# EAGLE schematic GPS_radiologger_v10 (EAGLE 9.5.1)
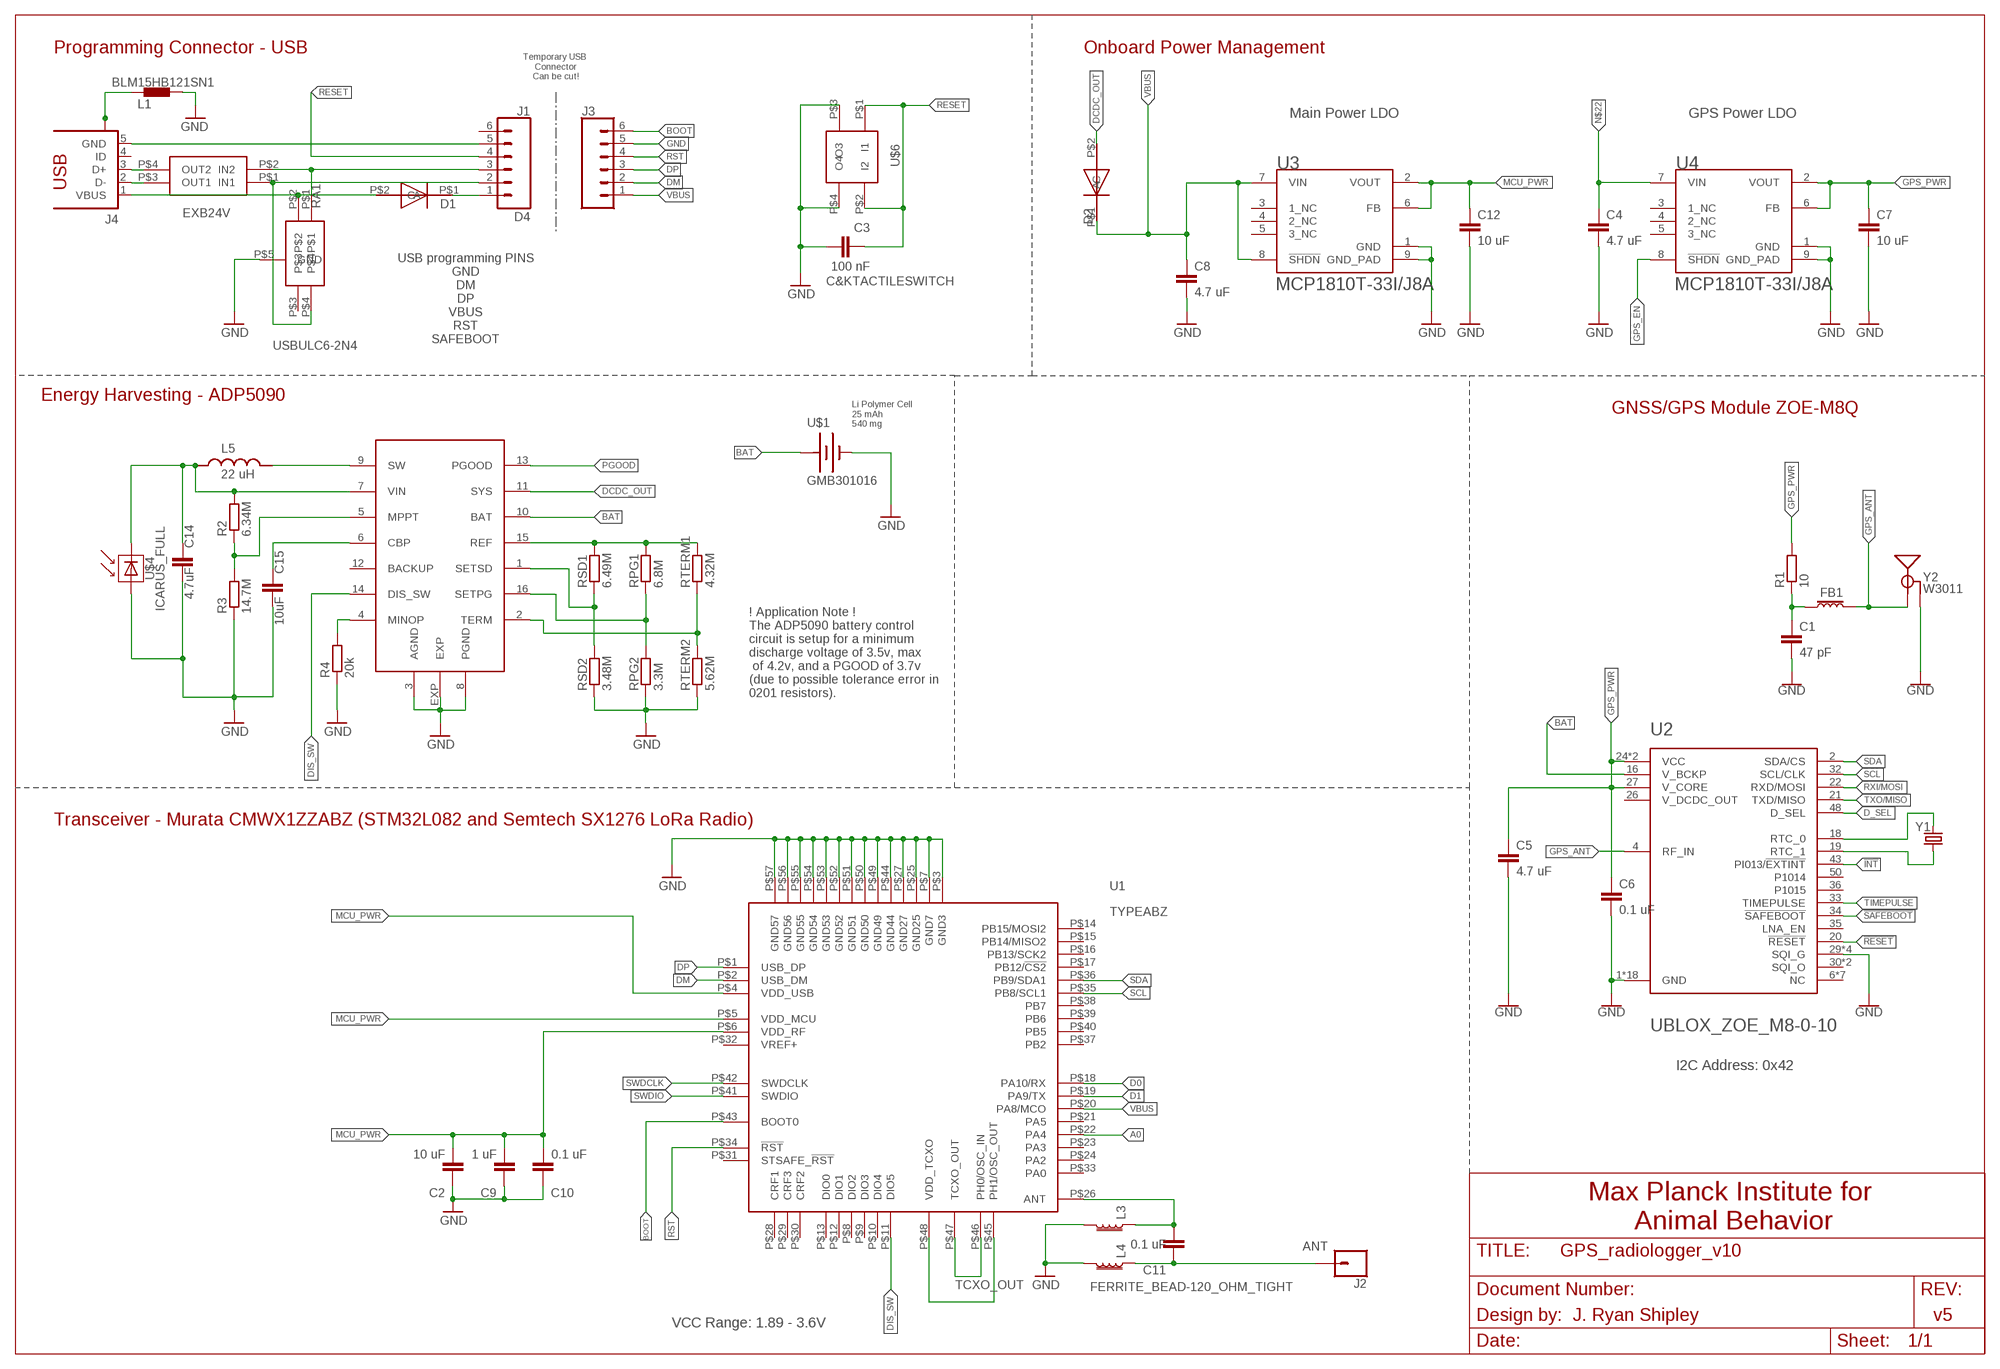
[diagram p0: schematic, sheet 1]

## Parts
C1  47 pF  C-EUC0201  [C0201]
C2  10 uF  C-EUC0201  [C0201]
C3  100 nF  0402CAP.KW  [0402-CAP]
C4  4.7 uF  C-EUC0201  [C0201]
C5  4.7 uF  C-EUC0201  [C0201]
C6  0.1 uF  C-EUC0201  [C0201]
C7  10 uF  C-EUC0201  [C0201]
C8  4.7 uF  C-EUC0201  [C0201]
C9  1 uF  C-EUC0201  [C0201]
C10  0.1 uF  C-EUC0201  [C0201]
C11  0.1 uF  C-EUC0201  [C0201]
C12  10 uF  C-EUC0201  [C0201]
C14  4.7uF  C-EUC0201  [C0201]
C15  10uF  C-EUC0402  [C0402]
D1  CDSQR4148-HF  [CDSQR4148-HF]
D2  CDSQR4148-HF  [CDSQR4148-HF]
D4  USBULC6-2N4  [USBULC6-2N4]
FB1  FERRITE_BEAD-120_OHM_TIGHT  [0402-TIGHT]
J1  CONN_061.27MM  [1X06_1.27MM]
J2  CONN_01PTH_NO_SILK_SMALL  [1X01_SMALL]
J3  CONN_061.27MM  [1X06_1.27MM]
J4  1981584-1  [1981584-1]
L1  BLM15HB121SN1  [0402]
L3  FERRITE_BEAD-120_OHM_TIGHT  [0402-TIGHT]
L4  FERRITE_BEAD-120_OHM_TIGHT  [0402-TIGHT]
L5  22 uH  LPS4012-103MRB  [IND_LPS4012-103MRB]
R1  10  R-EU_R0201  [R0201]
R2  6.34M  R-EU_R0201  [R0201]
R3  14.7M  R-EU_R0201  [R0201]
R4  20k  R-EU_R0201  [R0201]
RA1  EXB24V  [EXB24V]
RPG1  6.8M  R-EU_R0201  [R0201]
RPG2  3.3M  R-EU_R0201  [R0201]
RSD1  6.49M  R-EU_R0201  [R0201]
RSD2  3.48M  R-EU_R0201  [R0201]
RTERM1  4.32M  R-EU_R0201  [R0201]
RTERM2  5.62M  R-EU_R0201  [R0201]
U1  TYPEABZ  [TYPEABZ]
U2  UBLOX_ZOE_M8-0-10  [UBLOX_ZOE_M8-0-10]
U3  MICROCHIP_MCP1810T-33I-J8AMICROCHIP_MCP1810T-33I-J8A_0_0  [MICROCHIP_MCP1810T-33I-J8A_0]
U4  MICROCHIP_MCP1810T-33I-J8AMICROCHIP_MCP1810T-33I-J8A_0_0  [MICROCHIP_MCP1810T-33I-J8A_0]
U$1  GMB301016  [GMB301016]
U$3  ADP5090  [LFCSP-16-3X3]
U$4  ICARUS_FULL  [ICARUS_FULL]
U$6  C&KTACTILESWITCH  [C&KTACTILESWITCH]
Y1  32.768kHz  CRYSTAL-32.768KHZ  [CRYSTAL-SMD-1.0X1.2MM]
Y2  W3011  GPS_CHIP_ANTENNAW3011  [W3011]

## Nets
!INT: U2.43(PI013/!EXTINT)
!RESET: U2.20(!RESET)
!SAFEBOOT: U2.34(!SAFEBOOT)
A0: U1.P$22(PA4)
ANT: C11.1 J2.P$1 L4.1
BAT: U2.16(V_BCKP) U$1.+ U$3.10(BAT)
BOOT: J3.6 U1.P$43(BOOT0)
D0: U1.P$18(PA10/RX)
D1: U1.P$19(PA9/TX)
D_SEL: U2.48(D_SEL)
DCDC_OUT: D2.P$2(A) U$3.11(SYS)
DIS_SW: U1.P$11(DIO5) U$3.14(DIS_SW)
DM: J3.2 U1.P$2(USB_DM)
DM1: D4.P$4 J1.2 RA1.P$1(IN1)
DP: J3.3 U1.P$1(USB_DP)
DP1: D4.P$1 J1.3 RA1.P$2(IN2)
GND: C1.2 C2.1 C3.1 C4.2 C5.2 C6.2 C7.2 C8.2 C9.1 C10.1 C12.2 C14.2 C15.2 D4.P$5(GND) J1.5 J3.5 J4.5(GND) L1.2 L3.2 L4.2 R3.1 R4.1 RPG2.1 RSD2.1 RTERM2.1 U1.P$3(GND3) U1.P$7(GND7) U1.P$25(GND25) U1.P$27(GND27) U1.P$44(GND44) U1.P$49(GND49) U1.P$50(GND50) U1.P$51(GND51) U1.P$52(GND52) U1.P$53(GND53) U1.P$54(GND54) U1.P$55(GND55) U1.P$56(GND56) U1.P$57(GND57) U2.1(GND) U2.3(GND) U2.5(GND) U2.7(GND) U2.8(GND) U2.9(GND) U2.10(GND) U2.11(GND) U2.12(GND) U2.17(GND) U2.23(GND) U2.29(SQI_G) U2.31(SQI_G) U2.37(GND) U2.38(GND) U2.39(GND) U2.40(GND) U2.41(GND) U2.44(GND) U2.46(SQI_G) U2.47(SQI_G) U2.49(GND) U3.1(GND) U3.9(GND_PAD) U4.1(GND) U4.9(GND_PAD) U$1.- U$4.P$2(MINUS) U$6.P$3(O3) U$6.P$4(O4) Y2.2(GND) Y2.3(GND)
GPS_ANT: FB1.1 U2.4(RF_IN) Y2.1(SIGNAL)
GPS_EN: U4.8(!SHDN!)
GPS_PWR: C5.1 C6.1 C7.1 R1.2 U2.24(VCC) U2.25(VCC) U2.27(V_CORE) U4.2(VOUT) U4.6(FB)
MCU_PWR: C2.2 C9.2 C10.2 C12.1 U1.P$4(VDD_USB) U1.P$5(VDD_MCU) U1.P$6(VDD_RF) U3.2(VOUT) U3.6(FB)
N$1: U1.P$45(PH1/OSC_OUT) U1.P$48(VDD_TCXO)
N$2: D1.P$1(C) J1.1
N$5: L5.2 U$3.9(SW)
N$6: U$3.3(AGND) U$3.8(PGND) U$3.EXP ; supply symbol labelled GND
N$7: R2.1 R3.2 U$3.5(MPPT)
N$8: C15.1 U$3.6(CBP)
N$9: C1.1 FB1.2 R1.1
N$10: R4.2 U$3.4(MINOP)
N$11: RTERM1.1 RTERM2.2 U$3.2(TERM)
N$12: RPG1.1 RPG2.2 U$3.16(SETPG)
N$14: U2.18(RTC_0) Y1.P$2
N$15: U2.19(RTC_1) Y1.P$1
N$16: RSD1.1 RSD2.2 U$3.1(SETSD)
N$17: RPG1.2 RSD1.2 RTERM1.2 U$3.15(REF)
N$22: C4.1 U4.7(VIN)
N$31: J4.3(D+) RA1.P$4(OUT2)
N$32: C11.2 L3.1 U1.P$26(ANT)
N$33: J4.2(D-) RA1.P$3(OUT1)
PGOOD: U$3.13(PGOOD)
RESET: C3.2 J1.4 U$6.P$1(I1) U$6.P$2(I2)
RST: J3.4 U1.P$34(!RST)
RXI/MOSI: U2.22(RXD/MOSI)
SCL: U1.P$35(PB8/SCL1) U2.32(SCL/CLK)
SDA: U1.P$36(PB9/SDA1) U2.2(SDA/CS)
SWDCLK: U1.P$42(SWDCLK)
SWDIO: U1.P$41(SWDIO)
TCXO_OUT: U1.P$46(PH0/OSC_IN) U1.P$47(TCXO_OUT)
TIMEPULSE: U2.33(TIMEPULSE)
TXO/MISO: U2.21(TXD/MISO)
USB_SHIELD: J4.S1 J4.S2 J4.S3 J4.S4 L1.1
VBUS: C8.1 D2.P$1(C) J3.1 U1.P$20(PA8/MCO) U3.7(VIN) U3.8(!SHDN!)
VBUS1: D1.P$2(A) D4.P$2 J4.1(VBUS)
VIN: C14.1 L5.1 R2.2 U$3.7(VIN) U$4.P$1(PLUS)
Unconnected: D4.P$3 J1.6 J4.4(ID) U1.P$8(DIO2) U1.P$9(DIO3) U1.P$10(DIO4) U1.P$12(DIO1) U1.P$13(DIO0) U1.P$14(PB15/MOSI2) U1.P$15(PB14/MISO2) U1.P$16(PB13/SCK2) U1.P$17(PB12/!CS2) U1.P$21(PA5) U1.P$23(PA3) U1.P$24(PA2) U1.P$28(CRF1) U1.P$29(CRF3) U1.P$30(CRF2) U1.P$31(STSAFE_!RST) U1.P$33(PA0) U1.P$37(PB2) U1.P$38(PB7) U1.P$39(PB6) U1.P$40(PB5) U2.6(NC) U2.13(NC) U2.14(NC) U2.15(NC) U2.28(NC) U2.30(SQI_O) U2.35(LNA_EN) U2.36(P1015) U2.42(NC) U2.45(SQI_O) U2.50(P1014) U2.51(NC) U3.3(1_NC) U3.4(2_NC) U3.5(3_NC) U4.3(1_NC) U4.4(2_NC) U4.5(3_NC) U$3.12(BACKUP)

## Notes on the sheet
- Programming Connector - USB | Onboard Power Management
- Temporary USB 
  Connector
  Can be cut!
- Main Power LDO | GPS Power LDO
- USB programming PINS
  GND
  DM
  DP
  VBUS
  RST
  SAFEBOOT
- Energy Harvesting - ADP5090
- GNSS/GPS Module ZOE-M8Q
- Li Polymer Cell
  25 mAh
  540 mg
- ! Application Note !
  The ADP5090 battery control
  circuit is setup for a minimum
  discharge voltage of 3.5v, max
   of 4.2v, and a PGOOD of 3.7v
  (due to possible tolerance error in 
  0201 resistors).
- Transceiver - Murata CMWX1ZZABZ (STM32L082 and Semtech SX1276 LoRa Radio)
- I2C Address: 0x42
- Max Planck Institute for 
  Animal Behavior
- Design by: | J. Ryan Shipley | v5
- VCC Range: 1.89 - 3.6V

## Power pins joined to a net without a drawn wire
V_DCDC_OUT: U2.26(V_DCDC_OUT)
VREF+: U1.P$32(VREF+)

## Library data of the parts
C1 C2 C4-C12 C14 = rcl:C-EU: CAPACITOR, European symbol; SPICEPREFIX: C
C3 = SparkFun-Capacitors:0402CAP.KW
C15 = resistor:C-EU: CAPACITOR, European symbol
D1 D2 = Kris:CDSQR4148-HF: ComChip's CDSQR4148-HF high speed 150 mA Io diode
D4 = Kris:USBULC6-2N4: ST TVS diode ESD Protection USBULC6-2N4
FB1 L3 L4 = SparkFun-Coils:FERRITE_BEAD-120_OHM_TIGHT
J1 J3 = SparkFun-Connectors:CONN_06: Multi connection point. Often used as Generic Header-pin footprint for 0.1 inch spaced/style header connections On any of the 0.1 inch spaced packages, you can populate with these: Break Away Headers - Straight <https://www.sparkfun.com/products/116> (PRT-00116) Break Away Male Headers - Right Angle <https://www.sparkfun.com/products/553> (PRT-00553) Female Headers <https://www.sparkfun.com/products/115> (PRT-00115) Break Away Headers - Machine Pin <https://www.sparkfun.com/products/117> (PRT-00117) Break Away Female Headers - Swiss Machine Pin <https://www.sparkfun.com/products/743> (PRT-00743) Arduino Stackable Header - 6 Pin <https://www.sparkfun.com/products/9280> (PRT-09280) For SCREWTERMINALS and SPRING TERMINALS visit here: Screw Terimnals on SparkFun.com <https://www.sparkfun.com/search/results?term=Screw+Terminals> (5mm/3.5mm/2.54mm spacing) This device is also useful as a general connection point to wire up your design to another part of your project. Our various solder wires solder well into these plated through hole pads. Hook-Up Wire - Assortment (Stranded, 22 AWG) <https://www.sparkfun.com/products/11375> (PRT-11375) Hook-Up Wire - Assortment (Solid Core, 22 AWG) <https://www.sparkfun.com/products/11367> (PRT-11367) View the entire wire category on our website here <https://www.sparkfun.com/categories/141>
J2 = SparkFun-Connectors:CONN_01: Single connection point. Often used as Generic Header-pin footprint for 0.1 inch spaced/style header connections On any of the 0.1 inch spaced packages, you can populate with these: Break Away Headers - Straight <https://www.sparkfun.com/products/116> (PRT-00116) Break Away Male Headers - Right Angle <https://www.sparkfun.com/products/553> (PRT-00553) Female Headers <https://www.sparkfun.com/products/115> (PRT-00115) Break Away Headers - Machine Pin <https://www.sparkfun.com/products/117> (PRT-00117) Break Away Female Headers - Swiss Machine Pin <https://www.sparkfun.com/products/743> (PRT-00743) This device is also useful as a general connection point to wire up your design to another part of your project. Our various solder wires solder well into these plated through hole pads. Hook-Up Wire - Assortment (Stranded, 22 AWG) <https://www.sparkfun.com/products/11375> (PRT-11375) Hook-Up Wire - Assortment (Solid Core, 22 AWG) <https://www.sparkfun.com/products/11367> (PRT-11367) View the entire wire category on our website here <https://www.sparkfun.com/categories/141> Special notes: SMTSO-256-ET is a "flush mount" nut for a 4-40 screw. We mostly use this on specialty testbeds; it is a nice way to connect hardware to your PCB at an adjustable hieght. Also note, the SNAP packages are for using a snappable style connector. We sell a baggie of snaps and they are also used on two LilyPad designs: Snap Assortment - 30 pack (male and female) <https://www.sparkfun.com/products/11347> (DEV-11347) LilyPad Arduino SimpleSnap <https://www.sparkfun.com/products/10941> (DEV-10941) LilyPad SimpleSnap Protoboard <https://www.sparkfun.com/products/10940> (DEV-10940)
J4 = con-usb:1981584-1: Receptacle, micro-USB, type A/B Tyco Electronics; MF: Hirose; MPN: ZX62-AB-5PA(11)
L1 = inductors:BLM15H: EMIFIL (R) Chip Ferrite Bead for GHz Noise Source: http://www.murata.com/ Ferrite Bead BLM15H.pdf
L5 = LPS4012-103MRB:LPS4012-103MRB: Power inductor, shielded, 20/30% tol, SMT, RoHS, lead-free, halogen-free; AVAILABILITY: Unavailable; DESCRIPTION: Power inductor, shielded, 20/30% tol, SMT, RoHS, lead-free, halogen-free; MF: Coilcraft; MP: LPS4012-103MRB; PACKAGE: None; PRICE: None
R1 RSD1 RTERM1 = rcl:R-EU_: RESISTOR, European symbol; SPICEPREFIX: R
R2-R4 RPG1 RPG2 RSD2 RTERM2 = resistor:R-EU_: RESISTOR, European symbol
RA1 = Kris:EXB24V: Panasonic EXB24 22 Ohm series resistor pair
U1 = Kris:TYPEABZ: CMWX1ZZABZ-078
U2 = SparkFun-GPS:UBLOX_ZOE_M8-0-10: UBLOX ZOE-M8Q-0-10 u-blox ZOE-M8 standard precision GNSS SiP (System in Package) modules feature the high performance u-blox M8 GNSS engine. ZOE-M8’s ultra-miniature form factor integrates a complete GNSS receiver including SAW filter, LNA and TCXO. Handles all GNSS systems and can simulatenously use up to three of them, with accuracy ranging from 2.5m to 4m. GPS GLONASS BeiDou Galileo This can be corrected with the SBAS or QZSS augmentation systems.; PROD_ID: IC-14251
U3 U4 = MCP1810:MICROCHIP_MCP1810T-33I-J8A: Ultra-Low Quiescent Current LDO Regulator; CENTROID_NOT_SPECIFIED: No; DATASHEET: http://ww1.microchip.com/downloads/en/DeviceDoc/20005623A.pdf; DIGIKEY_DESCRIPTION: IC REG LINEAR 150MA 8-VDFN; DIGIKEY_PART_NUMBER: MCP1810T-33I/J8ACT-ND; IPC_LAND_PATTERN_NAME: DFN200X200X85-8; LEAD_FREE: yes; MF: Microchip; MFG_PACKAGE_IDENT: C04-3207A; MOUSER_PART_NUMBER: 579-MCP1810T-33I/J8A; MPN: MCP1810T-33I/J8A; PACKAGE: VDFN8; PREFIX: U; ROHS: yes; TEMPERATURE_RANGE_HIGH: +85°C; TEMPERATURE_RANGE_LOW: -40°C
U$1 = Powerstream:GMB301016
U$3 = ADP5090_LFCSP-16-3X3:ADP5090
U$4 = TrisolX_Solar_Cells:ICARUS_FULL
U$6 = Kris:C&KTACTILESWITCH: C&K Tactile Switch 611-PTS810SJS250SMTR
Y1 = SparkFun-Clocks:CRYSTAL-32.768KHZ: 32.768kHz Crystal Frequency: 32.768kHz Frequency Stability: ±20ppm Load Capacitance: 12.5pF (PTH-2X6 & SMD-3.2X1.5), 6pF (SMD-2X6) SparkFun Products: SparkFun BigTime Watch Kit <https://www.sparkfun.com/products/11734> SparkFun nRF52832 Breakout <https://www.sparkfun.com/products/13990> SparkFun Real Time Clock Module <https://www.sparkfun.com/products/12708>; XTAL: SC12S-7PF20PPM
Y2 = SparkFun-GPS:GPS_CHIP_ANTENNA; PROD_ID: ANT-14304

## Net classes
1 vcc: width 0 mm